# Altium schematic sheet 04_Supply Monitoring.SchDoc
size A2; SheetNumber: 4; SheetTotal: 14
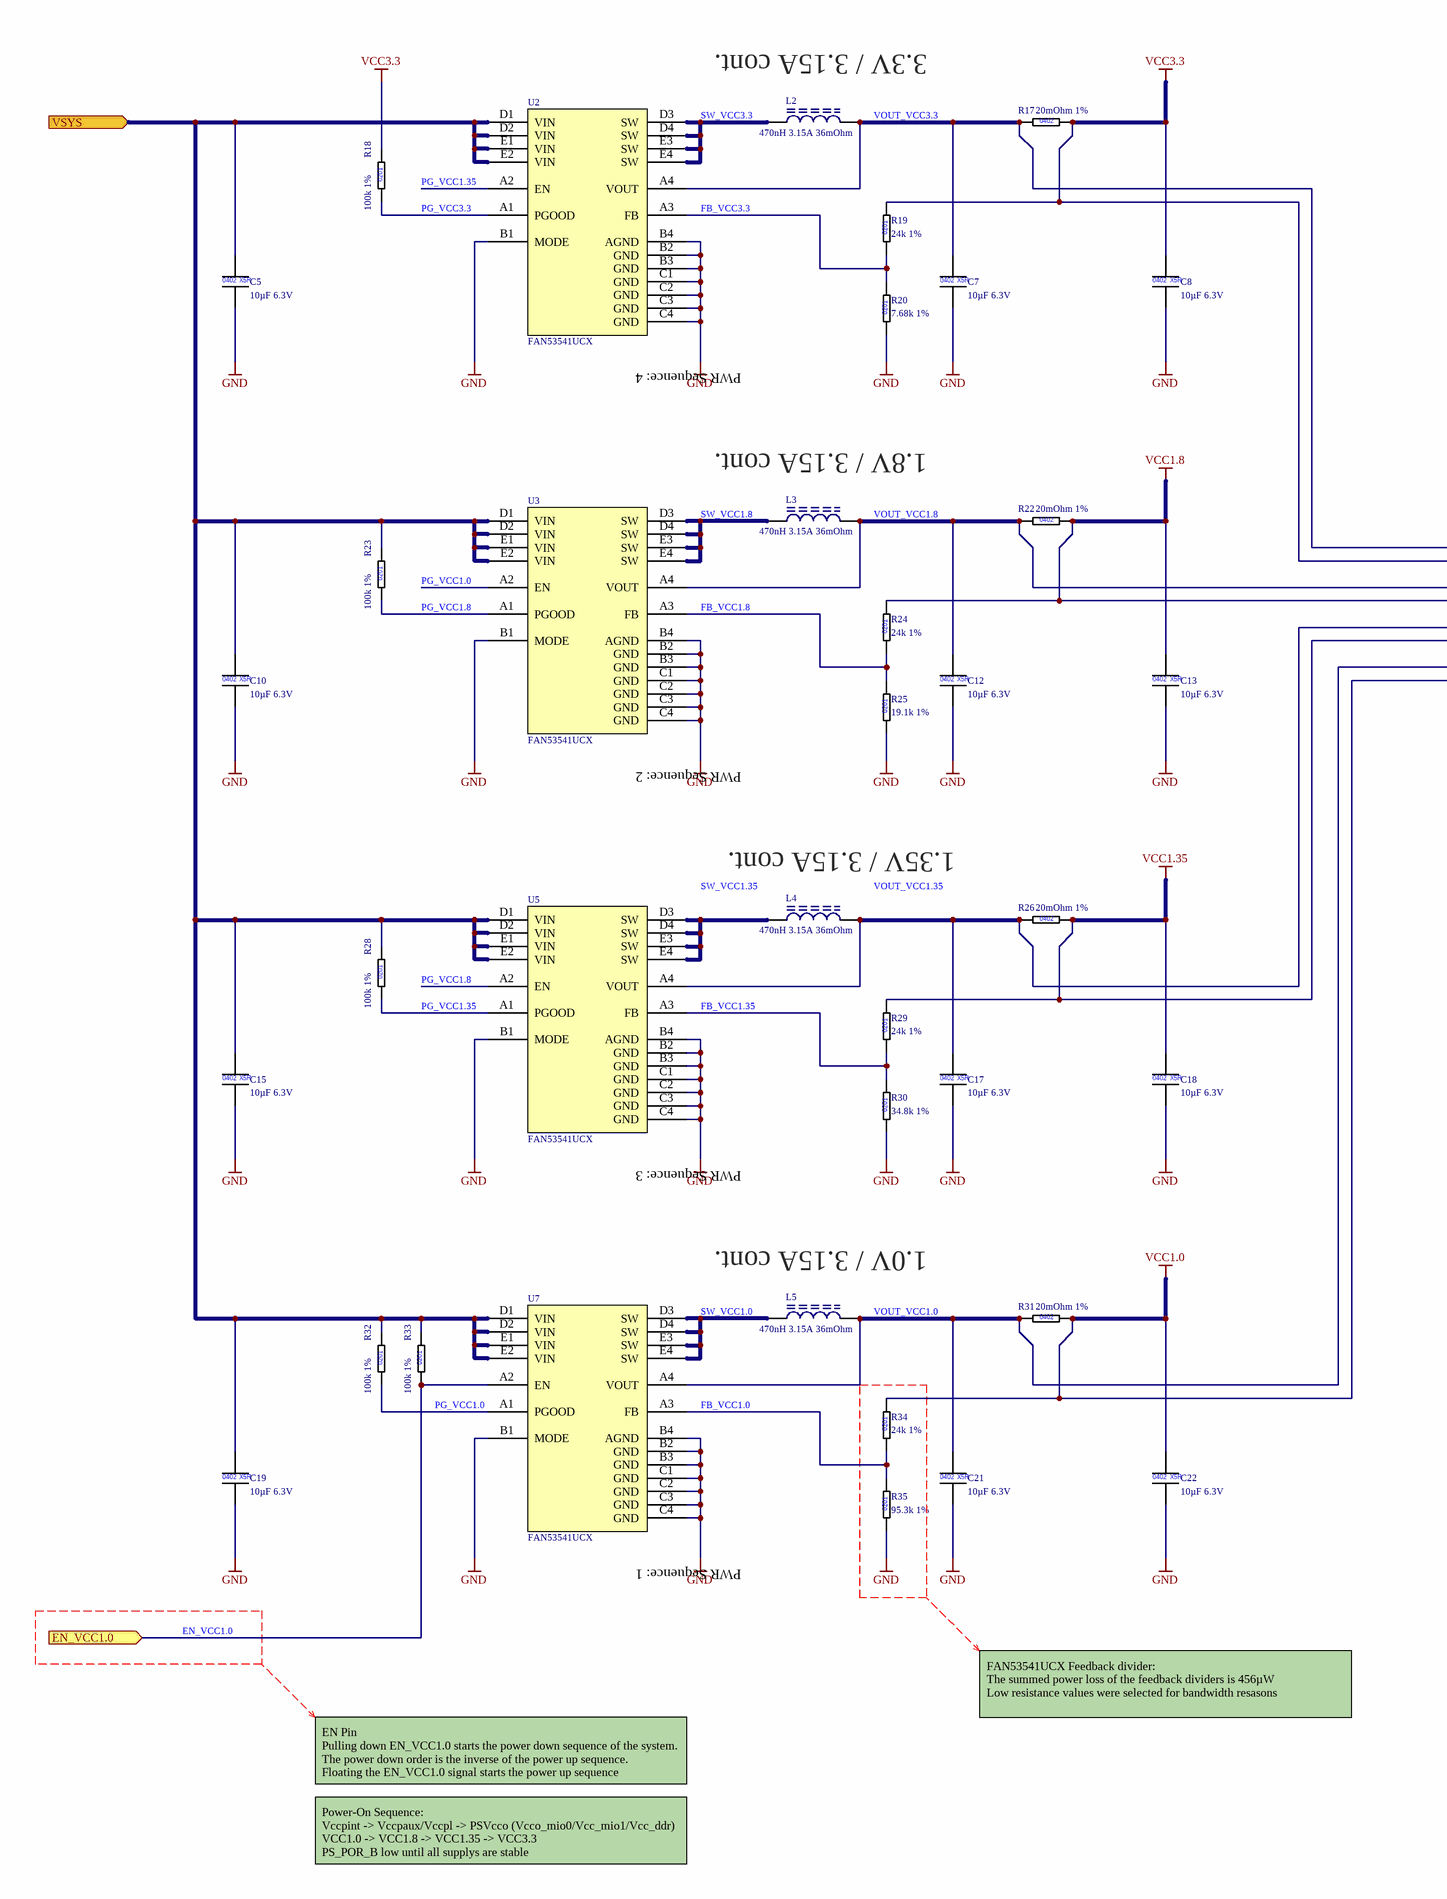
[diagram p0: 04_Supply Monitoring.SchDoc, left]
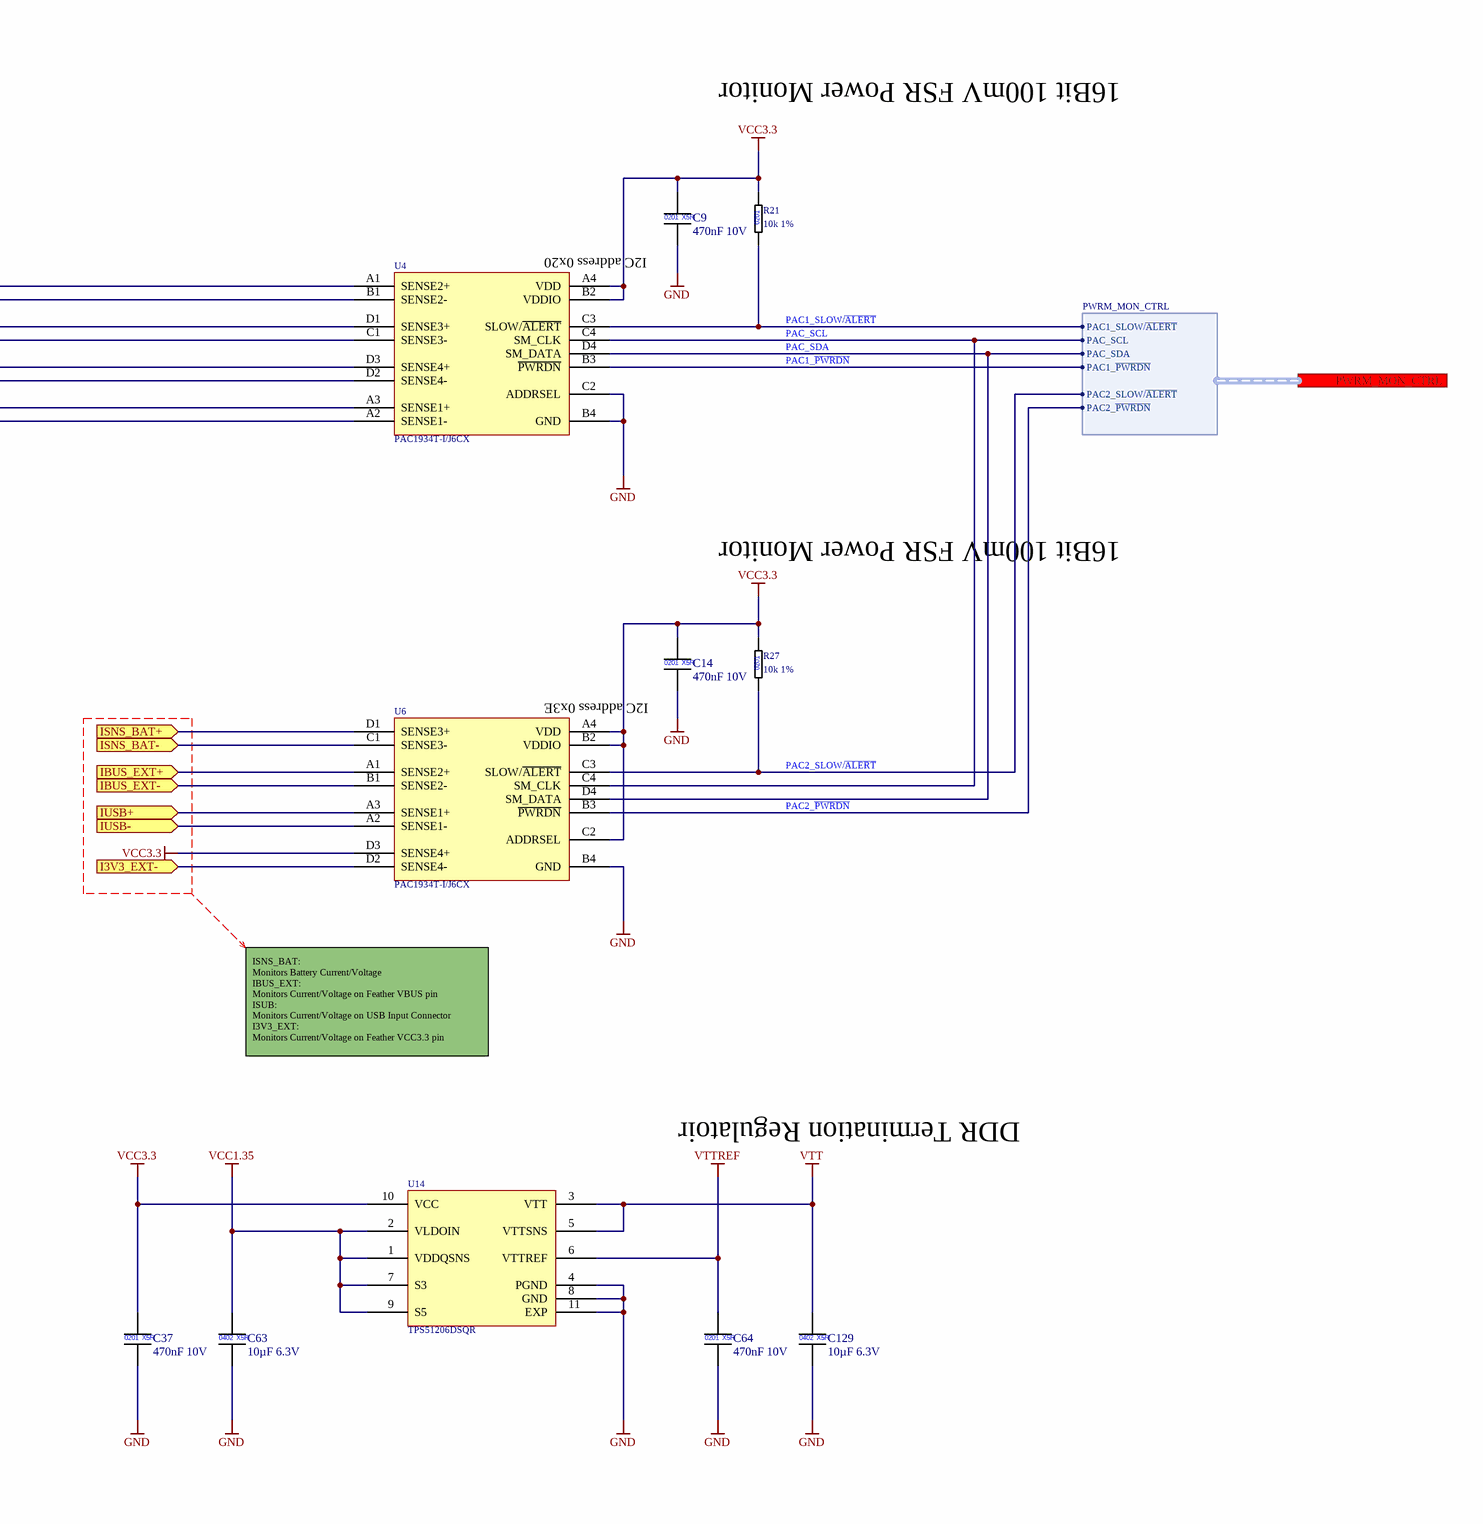
[diagram p1: 04_Supply Monitoring.SchDoc, right]

## Parts
C5  10µF 6.3V  [CAPC1005X06L]
C7  10µF 6.3V  [CAPC1005X06L]
C8  10µF 6.3V  [CAPC1005X06L]
C9  470nF 10V  [CAPC0603X03L]
C10  10µF 6.3V  [CAPC1005X06L]
C12  10µF 6.3V  [CAPC1005X06L]
C13  10µF 6.3V  [CAPC1005X06L]
C14  470nF 10V  [CAPC0603X03L]
C15  10µF 6.3V  [CAPC1005X06L]
C17  10µF 6.3V  [CAPC1005X06L]
C18  10µF 6.3V  [CAPC1005X06L]
C19  10µF 6.3V  [CAPC1005X06L]
C21  10µF 6.3V  [CAPC1005X06L]
C22  10µF 6.3V  [CAPC1005X06L]
C37  470nF 10V  [CAPC0603X03L]
C63  10µF 6.3V  [CAPC1005X06L]
C64  470nF 10V  [CAPC0603X03L]
C129  10µF 6.3V  [CAPC1005X06L]
L2  470nH 3.15A 36mOhm  [INDC2013X08L]
L3  470nH 3.15A 36mOhm  [INDC2013X08L]
L4  470nH 3.15A 36mOhm  [INDC2013X08L]
L5  470nH 3.15A 36mOhm  [INDC2013X08L]
R17  20mOhm 1%  [RESC1005X04L]
R18  100k 1%  [RESC0603X03L]
R19  24k 1%  [RESC0603X03L]
R20  7.68k 1%  [RESC0603X03L]
R21  10k 1%  [RESC0603X03L]
R22  20mOhm 1%  [RESC1005X04L]
R23  100k 1%  [RESC0603X03L]
R24  24k 1%  [RESC0603X03L]
R25  19.1k 1%  [RESC0603X03L]
R26  20mOhm 1%  [RESC1005X04L]
R27  10k 1%  [RESC0603X03L]
R28  100k 1%  [RESC0603X03L]
R29  24k 1%  [RESC0603X03L]
R30  34.8k 1%  [RESC0603X03L]
R31  20mOhm 1%  [RESC1005X04L]
R32  100k 1%  [RESC0603X03L]
R33  100k 1%  [RESC0603X03L]
R34  24k 1%  [RESC0603X03L]
R35  95.3k 1%  [RESC0603X03L]
U2  FAN53541UCX  [BGA20C40P4X5_156X196X59]
U3  FAN53541UCX  [BGA20C40P4X5_156X196X59]
U4  PAC1934T-I/J6CX  [BGA16C50P4X4_222X217X68]
U5  FAN53541UCX  [BGA20C40P4X5_156X196X59]
U6  PAC1934T-I/J6CX  [BGA16C50P4X4_222X217X68]
U7  FAN53541UCX  [BGA20C40P4X5_156X196X59]
U14  TPS51206DSQR  [SON40P200X80_HS-11L_TPS]

## Ports
EN_VCC1.0 (in), I3V3_EXT- (in), IBUS_EXT+ (in), IBUS_EXT- (in), ISNS_BAT+ (in), ISNS_BAT- (in), IUSB+ (in), IUSB- (in), PWRM_MON_CTRL (harness PWRM_MON_CTRL), VSYS (in)

## Harnesses
PWRM_MON_CTRL: PAC1_SLOW/~{ALERT}, PAC_SCL, PAC1_~{PWRDN}, PAC_SDA, PAC2_SLOW/~{ALERT}, PAC2_~{PWRDN}

## Nets
GND: C5.2 C7.2 C8.2 C9.2 C10.2 C12.2 C13.2 C14.2 C15.2 C17.2 C18.2 C19.2 C21.2 C22.2 C37.2 C63.2 C64.2 C129.2 R20.1 R25.1 R30.1 R35.1 U2.B1(MODE) U2.B2(GND) U2.B3(GND) U2.B4(AGND) U2.C1(GND) U2.C2(GND) U2.C3(GND) U2.C4(GND) U3.B1(MODE) U3.B2(GND) U3.B3(GND) U3.B4(AGND) U3.C1(GND) U3.C2(GND) U3.C3(GND) U3.C4(GND) U4.B4(GND) U4.C2(ADDRSEL) U5.B1(MODE) U5.B2(GND) U5.B3(GND) U5.B4(AGND) U5.C1(GND) U5.C2(GND) U5.C3(GND) U5.C4(GND) U6.B4(GND) U7.B1(MODE) U7.B2(GND) U7.B3(GND) U7.B4(AGND) U7.C1(GND) U7.C2(GND) U7.C3(GND) U7.C4(GND) U14.4(PGND) U14.8(GND) U14.11(EXP)
VCC1.0: C22.1 R31.2 R34.2 U4.A2(SENSE1-)
VCC1.8: C13.1 R22.2 R24.2 U4.C1(SENSE3-)
VCC1.35: C18.1 C63.1 R26.2 R29.2 U4.D2(SENSE4-) U14.1(VDDQSNS) U14.2(VLDOIN) U14.7(S3) U14.9(S5)
VCC3.3: C8.1 C9.1 C14.1 C37.1 R17.2 R18.2 R19.2 R21.2 R27.2 U4.A4(VDD) U4.B1(SENSE2-) U4.B2(VDDIO) U6.A4(VDD) U6.B2(VDDIO) U6.C2(ADDRSEL) U6.D3(SENSE4+) U14.10(VCC)
VTT: C129.1 U14.3(VTT) U14.5(VTTSNS)
VTTREF: C64.1 U14.6(VTTREF)
EN_VCC1.0: R33.1 U7.A2(EN) ; port EN_VCC1.0
FB_VCC1.0: R34.1 R35.2 U7.A3(FB)
FB_VCC1.8: R24.1 R25.2 U3.A3(FB)
FB_VCC1.35: R29.1 R30.2 U5.A3(FB)
FB_VCC3.3: R19.1 R20.2 U2.A3(FB)
I3V3_EXT-: U6.D2(SENSE4-) ; port I3V3_EXT-
IBUS_EXT+: U6.A1(SENSE2+) ; port IBUS_EXT+
IBUS_EXT-: U6.B1(SENSE2-) ; port IBUS_EXT-
ISNS_BAT+: U6.D1(SENSE3+) ; port ISNS_BAT+
ISNS_BAT-: U6.C1(SENSE3-) ; port ISNS_BAT-
IUSB+: U6.A3(SENSE1+) ; port IUSB+
IUSB-: U6.A2(SENSE1-) ; port IUSB-
PAC1_~{PWRDN}: U4.B3(~{PWRDN}) ; port PWRM_MON_CTRL.PAC1_~{PWRDN}
PAC1_SLOW/~{ALERT}: R21.1 U4.C3(SLOW/~{ALERT}) ; port PWRM_MON_CTRL.PAC1_SLOW/~{ALERT}
PAC2_~{PWRDN}: U6.B3(~{PWRDN}) ; port PWRM_MON_CTRL.PAC2_~{PWRDN}
PAC2_SLOW/~{ALERT}: R27.1 U6.C3(SLOW/~{ALERT}) ; port PWRM_MON_CTRL.PAC2_SLOW/~{ALERT}
PAC_SCL: U4.C4(SM_CLK) U6.C4(SM_CLK) ; port PWRM_MON_CTRL.PAC_SCL
PAC_SDA: U4.D4(SM_DATA) U6.D4(SM_DATA) ; port PWRM_MON_CTRL.PAC_SDA
PG_VCC1.0: R32.1 U3.A2(EN) U7.A1(PGOOD)
PG_VCC1.8: R23.1 U3.A1(PGOOD) U5.A2(EN)
PG_VCC1.35: R28.1 U2.A2(EN) U5.A1(PGOOD)
PG_VCC3.3: R18.1 U2.A1(PGOOD)
SW_VCC1.0: L5.1 U7.D3(SW) U7.D4(SW) U7.E3(SW) U7.E4(SW)
SW_VCC1.8: L3.1 U3.D3(SW) U3.D4(SW) U3.E3(SW) U3.E4(SW)
SW_VCC3.3: L2.1 U2.D3(SW) U2.D4(SW) U2.E3(SW) U2.E4(SW)
VOUT_VCC1.0: C21.1 L5.2 R31.1 U4.A3(SENSE1+) U7.A4(VOUT)
VOUT_VCC1.8: C12.1 L3.2 R22.1 U3.A4(VOUT) U4.D1(SENSE3+)
VOUT_VCC3.3: C7.1 L2.2 R17.1 U2.A4(VOUT) U4.A1(SENSE2+)
VSYS: C5.1 C10.1 C15.1 C19.1 R23.2 R28.2 R32.2 R33.2 U2.D1(VIN) U2.D2(VIN) U2.E1(VIN) U2.E2(VIN) U3.D1(VIN) U3.D2(VIN) U3.E1(VIN) U3.E2(VIN) U5.D1(VIN) U5.D2(VIN) U5.E1(VIN) U5.E2(VIN) U7.D1(VIN) U7.D2(VIN) U7.E1(VIN) U7.E2(VIN) ; port VSYS
NetC17_1: C17.1 L4.2 R26.1 U4.D3(SENSE4+) U5.A4(VOUT)
NetL4_1: L4.1 U5.D3(SW) U5.D4(SW) U5.E3(SW) U5.E4(SW)

## Notes on the sheet
- (near U2) 3.3V / 3.15A cont.
- (near U2) PWR Sequence: 4
- 16Bit 100mV FSR Power Monitor
- (near U3) 1.8V / 3.15A cont.
- (near U4) I2C address 0x20
- (near U3) PWR Sequence: 2
- (near U5) 1.35V / 3.15A cont.
- (near U6) I2C address 0x3E
- (near U5) PWR Sequence: 3
- (near U7) 1.0V / 3.15A cont.
- ISNS_BAT:
  Monitors Battery Current/Voltage
  IBUS_EXT:
  Monitors Current/Voltage on Feather VBUS pin
  ISUB:
  Monitors Current/Voltage on USB Input Connector
  I3V3_EXT:
  Monitors Current/Voltage on Feather VCC3.3 pin
- DDR Termination Regulatoir
- (near U7) PWR Sequence: 1
- FAN53541UCX Feedback divider:
  The summed power loss of the feedback dividers is 456µW
  Low resistance values were selected for bandwidth resasons
- EN Pin
  Pulling down EN_VCC1.0 starts the power down sequence of the system.
  The power down order is the inverse of the power up sequence.
  Floating the EN_VCC1.0 signal starts the power up sequence
- Power-On Sequence:
  Vccpint -> Vccpaux/Vccpl -> PSVcco (Vcco_mio0/Vcc_mio1/Vcc_ddr)
  VCC1.0 -> VCC1.8 -> VCC1.35 -> VCC3.3
  PS_POR_B low until all supplys are stable
- Labels drawn without touching a wire or pin: SW_VCC1.35, VOUT_VCC1.35
- Title:
- ++CONFIDENTIAL++
- The  information  contained  in  these  documents  is  confidential,  privileged  and  only  for  the
  information of the intended recipient and may
  not be used, published or redistributed without
  the prior written consent from PCB Arts GmbH.
- Datum:
- Revision:
- Blatt:
- von:
- Zeit:
- Entwickler:
- Checked:
- Der transparenteste Entwicklungsdienstleister
  der Elektronik- und Softwareentwicklung
- https://pcb-arts.com/
- mail@pcb-arts.com
- (in symbol CAP_0201_470nF_10V) 0201; X5R
- (in symbol CAP_0402_10µ_6.3V) 0402; X5R
- (in symbol RES_0201_7.68k_1%) 0201
- (in symbol RES_0201_10k_1%) 0201
- (in symbol RES_0201_19.1k_1%) 0201
- (in symbol RES_0201_24k_1%) 0201
- (in symbol RES_0201_34.8k_1%) 0201
- (in symbol RES_0201_95.3k_1%) 0201
- (in symbol RES_0201_100k_1%) 0201
- (in symbol RES_0402_20mR_1%) 0402

## Library data of the parts
C5 C7 C8 C10 C12 C13 C15 C17-C19 C21 C22 C63 C129 = CAP_0402_10µ_6.3V: Multilayer Ceramic Capacitors MLCC - SMD/SMT 0402 6.3VDC; Manufacturer 1: Murata Electronics; Manufacturer 1 Prt. Nr.: GRM155C80J106ME11J; Manufacturer 2 Prt. Nr.: JMK105CBJ106MV-F; Manufacturer 2: Taiyo Yuden
C9 C14 C37 C64 = CAP_0201_470nF_10V: Multilayer Ceramic Capacitors MLCC - SMD/SMT 0201 10VDC; Manufacturer 1: Taiyo Yuden; Manufacturer 1 Prt. Nr.: LMK063BBJ474KPLF; Manufacturer 2 Prt. Nr.: C0603X5R1A474M030BC; Manufacturer 2: TDK
L2-L5 = IND_0805_470nH_3.15A: Fixed Inductors 0805 .47uH 3.15A 20% 36mOhms HiCur; Manufacturer Prt. Nr.: MCHK2012TR47M; Manufacturer: Taiyo Yuden
R17 R22 R26 R31 = RES_0402_20mR_1%: Thick Film Resistors - SMD 20mOHM 1%; Manufacturer 1: Yageo; Manufacturer 1 Prt. Nr.: PA0402FRL7T0R02L
R18 R23 R28 R32 R33 = RES_0201_100k_1%: Thick Film Resistors - SMD 100K OHM 1%; Manufacturer 1: Yageo; Manufacturer 1 Prt. Nr.: RC0201FR-07100KL; Manufacturer 2 Prt. Nr.: CRCW0201100KFNED; Manufacturer 2: Vishay / Dale
R19 R24 R29 R34 = RES_0201_24k_1%: Thick Film Resistors - SMD 24K OHM 1%; Manufacturer 1: Yageo; Manufacturer 1 Prt. Nr.: RC0201FR-0724KL; Manufacturer 2 Prt. Nr.: CRCW020124K0FKED; Manufacturer 2: Vishay / Dale
R20 = RES_0201_7.68k_1%: Thick Film Resistors - SMD 7.68K OHM 1%; Manufacturer 1: Yageo; Manufacturer 1 Prt. Nr.: RC0201FR-077K68L; Manufacturer 2 Prt. Nr.: CRCW02017K68FKED; Manufacturer 2: Vishay / Dale
R21 R27 = RES_0201_10k_1%: Thick Film Resistors - SMD 10K OHM 1%; Manufacturer 1: Yageo; Manufacturer 1 Prt. Nr.: RC0201FR-0710KL; Manufacturer 2 Prt. Nr.: CRCW020110K0FNED; Manufacturer 2: Vishay / Dale
R25 = RES_0201_19.1k_1%: Thick Film Resistors - SMD 19.1K OHM 1%; Manufacturer 1: Yageo; Manufacturer 1 Prt. Nr.: RC0201FR-0719K1L; Manufacturer 2 Prt. Nr.: CRCW020119K1FKED; Manufacturer 2: Vishay / Dale
R30 = RES_0201_34.8k_1%: Thick Film Resistors - SMD 34.8K OHM 1%; Manufacturer 1: Yageo; Manufacturer 1 Prt. Nr.: RC0201FR-0734K8L; Manufacturer 2 Prt. Nr.: CRCW020134K8FKED; Manufacturer 2: Vishay / Dale
R35 = RES_0201_95.3k_1%: Thick Film Resistors - SMD 95.3K OHM 1%; Manufacturer 1: Yageo; Manufacturer 1 Prt. Nr.: RC0201FR-0795K3L; Manufacturer 2 Prt. Nr.: CRCW020195K3FKED; Manufacturer 2: Vishay / Dale
U2 U3 U5 U7 = FAN53541UCX_2.4 MHz 5A Synchronous Buck Reg: Switching Voltage Regulators 2.4 MHz 5A Synchronous Buck Reg; Manufacturer: ON Semiconductor / Fairchild; Manufacturer Prt. Nr.: FAN53541UCX
U4 U6 = PAC1934T-I/J6CX_Quad High-Side Current Sensor, I2C/SMBus: Current & Power Monitors & Regulators Quad High-Side Current Sensor, I2C/SMBus, 32V with Accumulator; Manufacturer 1: Microchip Technology; Manufacturer 1 Prt. Nr.: PAC1934T-I/J6CX
U14 = TPS51206DSQR_2A Peak Sink/Source DDR Term Reg: Power Management Specialised - PMIC 2A Peak Sink/Source DDR Term Reg; Manufacturer 1: Texas Instruments; Manufacturer 1 Prt. Nr.: TPS51206DSQR